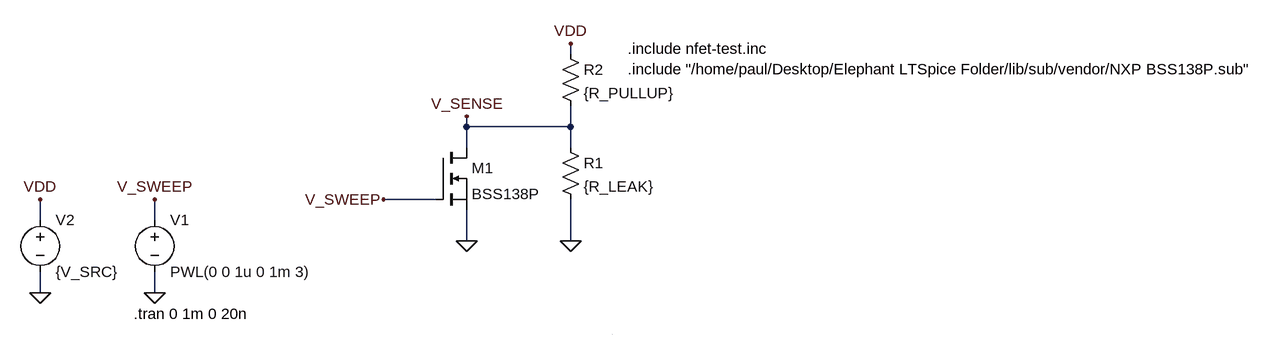
[diagram p0: schematic nfet-test.asc]
nfet-test.asc, the LTspice schematic file:
Version 4.1
SHEET 1 2496 1868
WIRE -64 -432 -64 -448
WIRE -224 -320 -224 -336
WIRE -64 -320 -64 -352
WIRE -64 -320 -224 -320
WIRE -224 -288 -224 -320
WIRE -64 -288 -64 -320
WIRE -272 -208 -352 -208
WIRE -880 -176 -880 -208
WIRE -704 -176 -704 -208
WIRE -224 -144 -224 -192
WIRE -64 -144 -64 -208
WIRE -880 -64 -880 -96
WIRE -704 -64 -704 -96
WIRE 0 0 0 0
FLAG -704 -64 0
FLAG -704 -208 V_SWEEP
FLAG -224 -144 0
FLAG -64 -144 0
FLAG -224 -336 V_SENSE
FLAG -352 -208 V_SWEEP
FLAG -880 -64 0
FLAG -880 -208 VDD
FLAG -64 -448 VDD
SYMBOL nmos -272 -288 R0
SYMATTR InstName M1
SYMATTR Value BSS138P
SYMATTR Prefix X
SYMBOL voltage -704 -192 R0
WINDOW 123 0 0 Left 0
WINDOW 39 0 0 Left 0
SYMATTR InstName V1
SYMATTR Value PWL(0 0 1u 0 1m 3)
SYMBOL res -80 -304 R0
SYMATTR InstName R1
SYMATTR Value {R_LEAK}
SYMBOL res -80 -448 R0
SYMATTR InstName R2
SYMATTR Value {R_PULLUP}
SYMBOL voltage -880 -192 R0
SYMATTR InstName V2
SYMATTR Value {V_SRC}
TEXT 24 -440 Left 2 !.include nfet-test.inc\n.include "/home/paul/Desktop/Elephant LTSpice Folder/lib/sub/vendor/NXP BSS138P.sub"
TEXT -736 -32 Left 2 !.tran 0 1m 0 20n

The netlist it stands for:
* nfet-test.asc
X§M1 V_SENSE V_SWEEP 0 BSS138P  ; pins D G S
V1 V_SWEEP 0 PWL(0 0 1u 0 1m 3)
R1 V_SENSE 0 {R_LEAK}
R2 VDD V_SENSE {R_PULLUP}
V2 VDD 0 {V_SRC}
.include nfet-test.inc
.include "/home/paul/Desktop/Elephant LTSpice Folder/lib/sub/vendor/NXP BSS138P.sub"
.tran 0 1m 0 20n
.backanno
.end